# Altium schematic sheet Sheet1.SchDoc
size A4
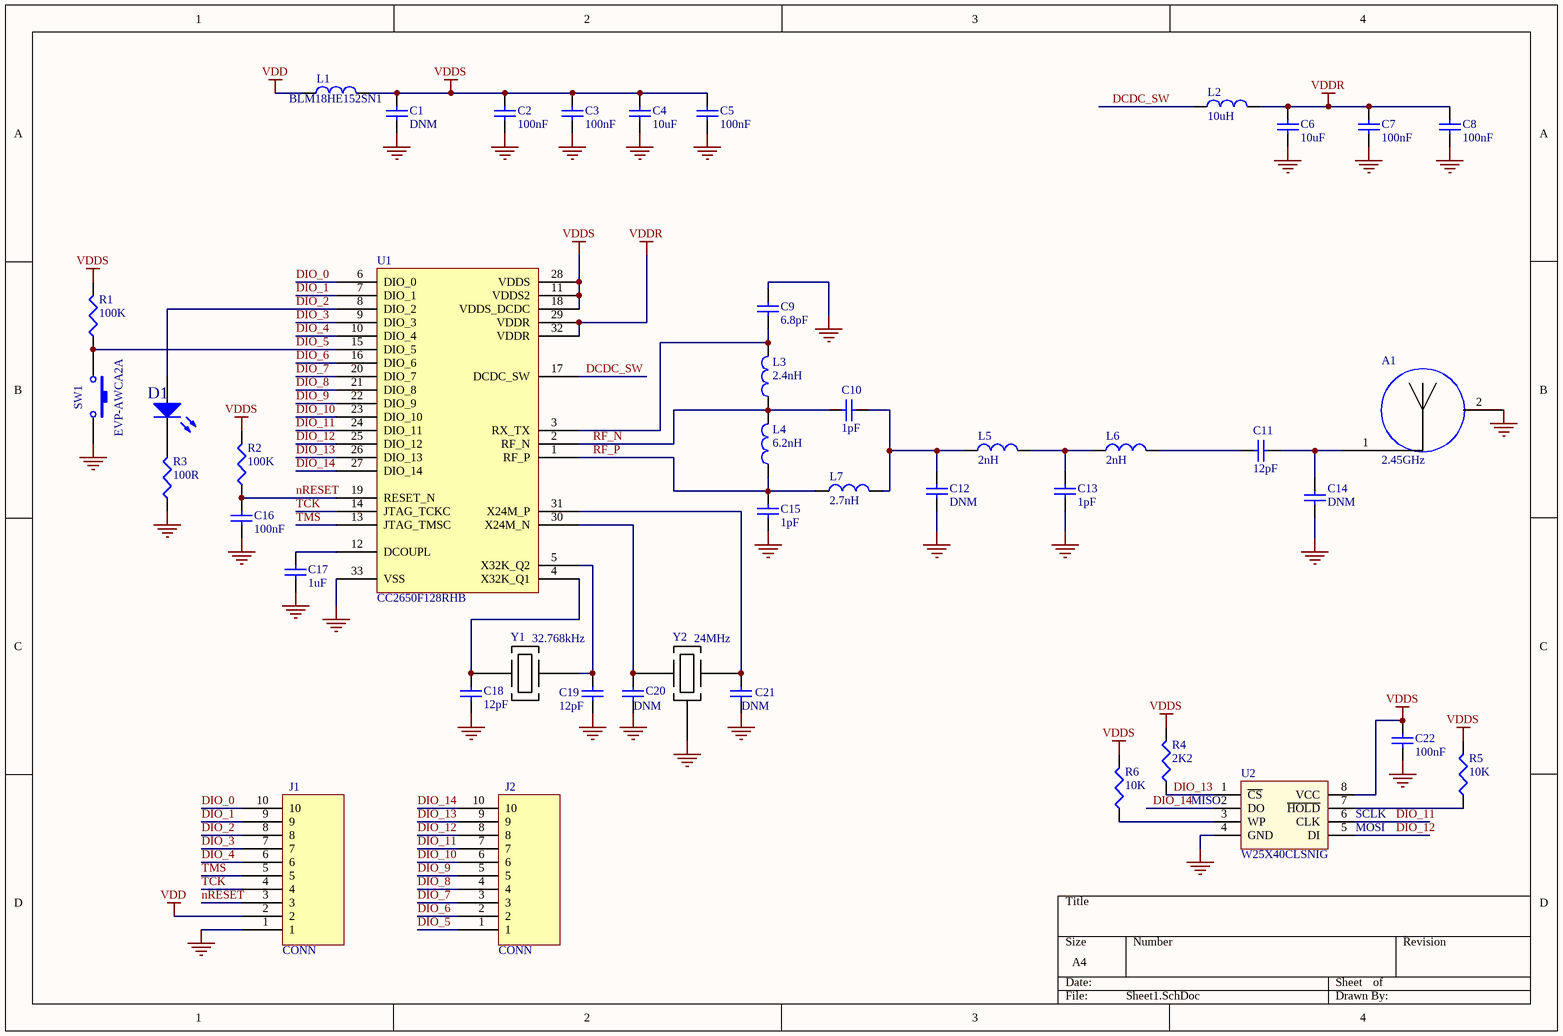
[diagram p0: Sheet1.SchDoc]

## Parts
A1  2.45GHz  [ANTENNA_PCB_INATEL3]
C1  DNM  [0402]
C2  100nF  [0402 - CAP]
C3  100nF  [0402 - CAP]
C4  10uF  [0603 - CAP]
C5  100nF  [0402 - CAP]
C6  10uF  [0603 - CAP]
C7  100nF  [0402 - CAP]
C8  100nF  [0402 - CAP]
C9  6.8pF  [0402 - CAP]
C10  1pF  [0402 - CAP]
C11  12pF  [0402 - CAP]
C12  DNM  [0402]
C13  1pF  [0402 - CAP]
C14  DNM  [0402]
C15  1pF  [0402 - CAP]
C16  100nF  [0402 - CAP]
C17  1uF  [0402 - CAP]
C18  12pF  [0402 - CAP]
C19  12pF  [0402 - CAP]
C20  DNM  [0402]
C21  DNM  [0402]
C22  100nF  [0402 - CAP]
D1  Status  [0603 - LED]  (value not drawn)
J1  CONN  [CONN_HEADER ARDUINO SHIELD]
J2  CONN  [CONN_HEADER ARDUINO SHIELD]
L1  BLM18HE152SN1  [0603 - IND]
L2  10uH  [0805 - CAP]
L3  2.4nH  [0402 - IND]
L4  6.2nH  [0402 - IND]
L5  2nH  [0402 - IND]
L6  2nH  [0402 - IND]
L7  2.7nH  [0402 - IND]
R1  100K  [0402 - RES]
R2  100K  [0402 - RES]
R3  100R  [0402 - RES]
R4  2K2  [0402 - RES]
R5  10K  [0402 - RES]
R6  10K  [0402 - RES]
SW1  EVP-AWCA2A  [EVP-AWCA2A]
U1  CC2650F128RHB  [CC2650F128RHB - cm]
U2  W25X40CLSNIG  [SOIC-8]
Y1  32.768kHz  [FC-12M]
Y2  24MHz  [XT_DFN_LCC_32x25]

## Nets
GND: A1.2 C1.1 C2.1 C3.1 C4.1 C5.1 C6.1 C7.1 C8.1 C9.2 C12.1 C13.1 C14.1 C15.2 C16.1 C17.1 C18.1 C19.1 C20.1 C21.1 C22.1 J2.1 R3.1 SW1.2 U1.33(VSS) U2.4(GND) Y2.3
VDD: J2.2 L1.2
VDDR: C6.2 C7.2 C8.2 L2.1 U1.29(VDDR) U1.32(VDDR)
VDDS: C1.2 C2.2 C3.2 C4.2 C5.2 C22.2 L1.1 R1.2 R2.2 R4.2 R5.2 R6.2 U1.11(VDDS2) U1.18(VDDS_DCDC) U1.28(VDDS) U2.8(VCC)
DCDC_SW: L2.2 U1.17(DCDC_SW)
DIO_0: J2.10 U1.6(DIO_0)
DIO_1: J2.9 U1.7(DIO_1)
DIO_2: D1.1(A) J2.8 U1.8(DIO_2)
DIO_3: J2.7 U1.9(DIO_3)
DIO_4: J2.6 U1.10(DIO_4)
DIO_5: J1.1 R1.1 SW1.1 U1.15(DIO_5)
DIO_6: J1.2 U1.16(DIO_6)
DIO_7: J1.3 U1.20(DIO_7)
DIO_8: J1.4 U1.21(DIO_8)
DIO_9: J1.5 U1.22(DIO_9)
DIO_10: J1.6 U1.23(DIO_10)
DIO_11: J1.7 U1.24(DIO_11) U2.6(CLK)
DIO_12: J1.8 U1.25(DIO_12) U2.5(DI)
DIO_13: J1.9 R4.1 U1.26(DIO_13) U2.1(~{CS})
DIO_14: J1.10 U1.27(DIO_14) U2.2(DO)
nRESET: C16.2 J2.3 R2.1 U1.19(RESET_N)
RF_N: C10.2 L3.1 L4.1 U1.2(RF_N)
RF_P: C15.1 L4.2 L7.2 U1.1(RF_P)
TCK: J2.4 U1.14(JTAG_TCKC)
TMS: J2.5 U1.13(JTAG_TMSC)
NetA1_1: A1.1 C11.1 C14.2
NetC9_1: C9.1 L3.2 U1.3(RX_TX)
NetC10_1: C10.1 C12.2 L5.2 L7.1
NetC11_2: C11.2 L6.1
NetC13_2: C13.2 L5.1 L6.2
NetC17_2: C17.2 U1.12(DCOUPL)
NetC18_2: C18.2 U1.4(X32K_Q1) Y1.1
NetC19_2: C19.2 U1.5(X32K_Q2) Y1.2
NetC20_2: C20.2 U1.30(X24M_N) Y2.1
NetC21_2: C21.2 U1.31(X24M_P) Y2.2
NetD1_2: D1.2(K) R3.2
NetR5_1: R5.1 U2.7(~{HOLD})
NetR6_1: R6.1 U2.3(WP)

Not connected (* = marked no-connect by the designer): Y1 3

## Notes on the sheet
- MISO
- (near U2) MOSI
- (near U2) SCLK

## Library data of the parts
A1 = ANTENNA 2.4GHz_INATEL: ANTENNA 2.4GHz INATEL; Details: ANTENNA 2.4GHz INATEL; Value: 2.45GHz; ClassName: RF
C1 C12 C14 C20 C21 = CAP: Value: DNM; Package: 0402
  C12 C14: ClassName: RF
C2 C3 C5 C7 C8 C16 C22 = CAP: CAP CER 0.1UF 6.3V 10% X7R 0402; Manufacturer: Murata; DK PN: 490-6319-1-ND; MFG PN: GRM155R70J104KA01D; Value: 100nF; Details: CAP CER 0.1UF 6.3V 10% X7R 0402; Package: 0402
C4 C6 = CAP: CAP CER 10UF 6.3V 20% X5R 0603; Manufacturer: Murata; DK PN: 490-3896-1-ND; MFG PN: GRM188R60J106ME47D; Value: 10uF; Details: CAP CER 10UF 6.3V 20% X5R 0603; Package: 0603
C9 = CAP: CAP CER 6.8PF 50V NP0 0402; Manufacturer: Murata; DK PN: 490-5949-1-ND; MFG PN: GRM1555C1H6R8CA01D; Value: 6.8pF; Details: CAP CER 6.8PF 50V NP0 0402; Package: 0402; ClassName: RF
C10 C13 C15 = CAP: CAP CER 1PF 50V NP0 0402; Manufacturer: Murata; DK PN: 490-6206-1-ND; MFG PN: GRM1555C1H1R0BA01D; Value: 1pF; Details: CAP CER 1PF 50V NP0 0402; Package: 0402; ClassName: RF
C11 C18 C19 = CAP: CAP CER 12PF 50V NP0 0402; Manufacturer: Murata; DK PN: 490-5924-2-ND; MFG PN: GRM1555C1H120JA01D; Value: 12pF; Details: CAP CER 12PF 50V NP0 0402; Package: 0402
  C11: ClassName: RF
C17 = CAP: CAP CER 1UF 10V 10% X5R 0402; Manufacturer: Murata; DK PN: 490-3890-1-ND; MFG PN: GRM155R61A105KE15D; Value: 1uF; Details: CAP CER 1UF 10V 10% X5R 0402; Package: 0402
D1 = LED_R: LED SUPER RED CLR THIN 0603 SMD; Manufacturer: Lite-On Inc; Value: Red LED; DK PN: 160-1182-2-ND; MFG PN: LTST-C190EKT; Details: LED SUPER RED CLR THIN 0603 SMD; Package: 0603
J1 J2 = CONN: 10POS SIL VERTICAL PIN HEADER; Manufacturer: Harwin Inc; Value: M20-9991046; DK PN: 952-1843-ND; Details: 10POS SIL VERTICAL PIN HEADER; MFG PN: M20-9991046; Package: CONN_HEADER ARDUINO SHIELD
L1 = INDUCTOR: FERRITE CHIP 1500 OHM 500MA 0603; Manufacturer: Murata; DK PN: 490-5216-1-ND; MFG PN: BLM18HE152SN1D; Value: BLM18HE152SN1; Details: FERRITE CHIP 1500 OHM 500MA 0603; Package: 0603
L2 = INDUCTOR: FIXED IND 10UH 110MA 520 MOHM; Manufacturer: Taiyo Yuden; DK PN: 587-2608-1-ND; MFG PN: CKS2125100M-T; Value: 10uH; Details: FIXED IND 10UH 110MA 520 MOHM; Package: 0805
L3 = INDUCTOR: FIXED IND 2.4NH 300MA 160 MOHM; Manufacturer: Murata; DK PN: 490-6559-1-ND; MFG PN: LQG15HN2N4S02D; Value: 2.4nH; Details: FIXED IND 2.4NH 300MA 160 MOHM; Package: 0402; ClassName: RF
L4 = INDUCTOR: FIXED IND 6.2NH 300MA 220 MOHM; Manufacturer: Murata; DK PN: 490-2620-2-ND; MFG PN: LQG15HS6N2S02D; Value: 6.2nH; Details: FIXED IND 6.2NH 300MA 220 MOHM; Package: 0402; ClassName: RF
L5 L6 = INDUCTOR: FIXED IND 2NH 300MA 100 MOHM SMD; Manufacturer: Murata; DK PN: 490-6569-1-ND; MFG PN: LQG15HS2N0S02D; Value: 2nH; Details: FIXED IND 2NH 300MA 100 MOHM SMD; Package: 0402; ClassName: RF
L7 = INDUCTOR: FIXED IND 2.7NH 300MA 150 MOHM; Manufacturer: Murata; DK PN: 490-2615-2-ND; MFG PN: LQG15HS2N7S02D; Value: 2.7nH; Details: FIXED IND 2.7NH 300MA 150 MOHM; Package: 0402; ClassName: RF
R1 R2 = RES: RES SMD 100K OHM 5% 1/10W 0402; Manufacturer: Panasonic; DK PN: P100KJCT-ND; MFG PN: ERJ-2GEJ104X; Value: 100K; Details: RES SMD 100K OHM 5% 1/10W 0402; Package: 0402
R3 = RES: RES SMD 100 OHM 5% 1/10W 0402; Manufacturer: Panasonic; DK PN: P100JTR-ND; MFG PN: ERJ-2GEJ101X; Value: 100R; Details: RES SMD 100 OHM 5% 1/10W 0402; Package: 0402
R4 = RES: RES SMD 2.2K OHM 5% 1/10W 0402; Manufacturer: Panasonic; DK PN: P2.2KJTR-ND; MFG PN: ERJ-2GEJ222X; Value: 2K2; Details: RES SMD 2.2K OHM 5% 1/10W 0402; Package: 0402
R5 R6 = RES: RES SMD 10K OHM 5% 1/10W 0402; Manufacturer: Panasonic; DK PN: P10KJTR-ND; MFG PN: ERJ-2GEJ103X; Value: 10K; Details: RES SMD 10K OHM 5% 1/10W 0402; Package: 0402
SW1 = SW_EVPAW: Tactile Switch SPST-NO Top Actuated Surface Mount; Manufacturer: Panasonic; DK PN: P16851CT-ND; MFG PN: EVP-AWCA2A; Value: EVP-AWCA2A; Package: 2-SMD; Details: Tactile Switch SPST-NO Top Actuated Surface Mount
U1 = CC2650F128RHB: IC MCU 128KB FLASH PHY 32VQFN; Manufacturer: TI; Value: CC2650F128RHBT; DK PN: 296-41955-1-ND; Details: IC MCU 128KB FLASH PHY 32VQFN; MFG PN: CC2650F128RHBT; Package: 32VQFN
U2 = SPI_FLASH_SOIC_8: IC FLASH 4MBIT 104MHZ 8SOIC; Manufacturer: Winbond; DK PN: W25X40CLSNIG TR-ND; MFG PN: W25X40CLSNIG TR; Details: IC FLASH 4MBIT 104MHZ 8SOIC; Value: W25X40CLSNIG; Package: SOIC-8
Y1 = XTAL1: Crystal 32.7680kHz 20ppm 12.5pF 90 kOhm -40°C - 85°C Surface Mount 2-SMD; Manufacturer: EPSON; DK PN: SER3672CT-ND; MFG PN: FC-12M 32.7680KA-A3; Value: 32.768kHz; Details: Crystal 32.7680kHz 20ppm 12.5pF 90 kOhm -40°C - 85°C Surface Mount 2-SMD; Package: FC-12M
Y2 = XTAL1: Crystal 24.0000MHz 10ppm 9pF 40 Ohm -40°C - 85°C Surface Mount 4-SMD, No Lead (DFN, LCC); Manufacturer: EPSON; DK PN: SER3635CT-ND; MFG PN: TSX-3225 24.0000MF15X-AC3; Value: 24MHz; Details: Crystal 24.0000MHz 10ppm 9pF 40 Ohm -40°C - 85°C Surface Mount 4-SMD, No Lead (DFN, LCC); Package: XT_DFN_LCC_32x25